# EasyEDA Pro project ax08_duplicate.eprj, board register
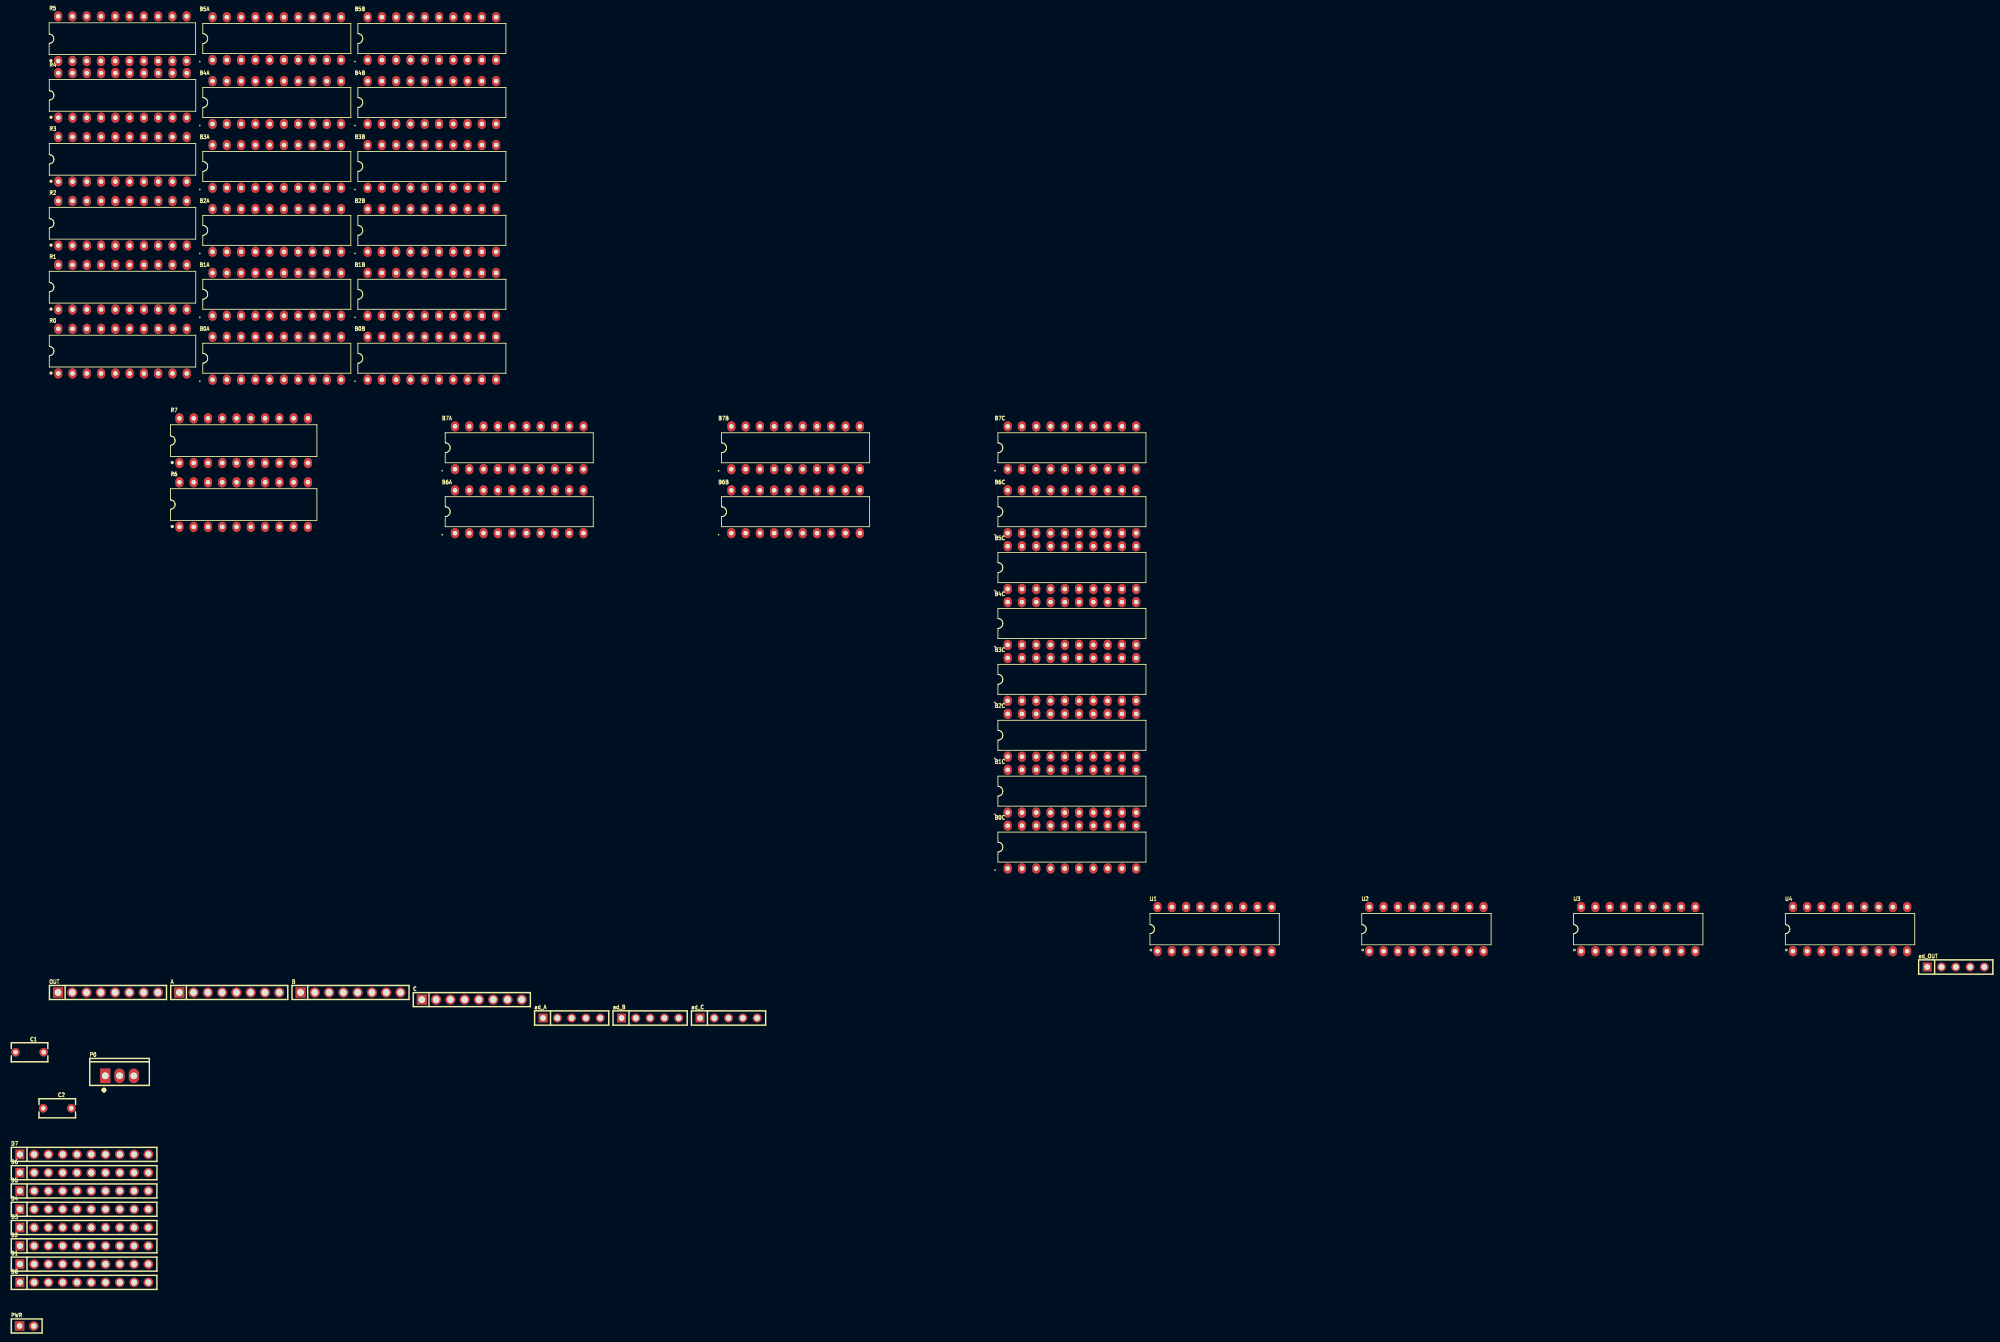
[diagram p9: board, top side]
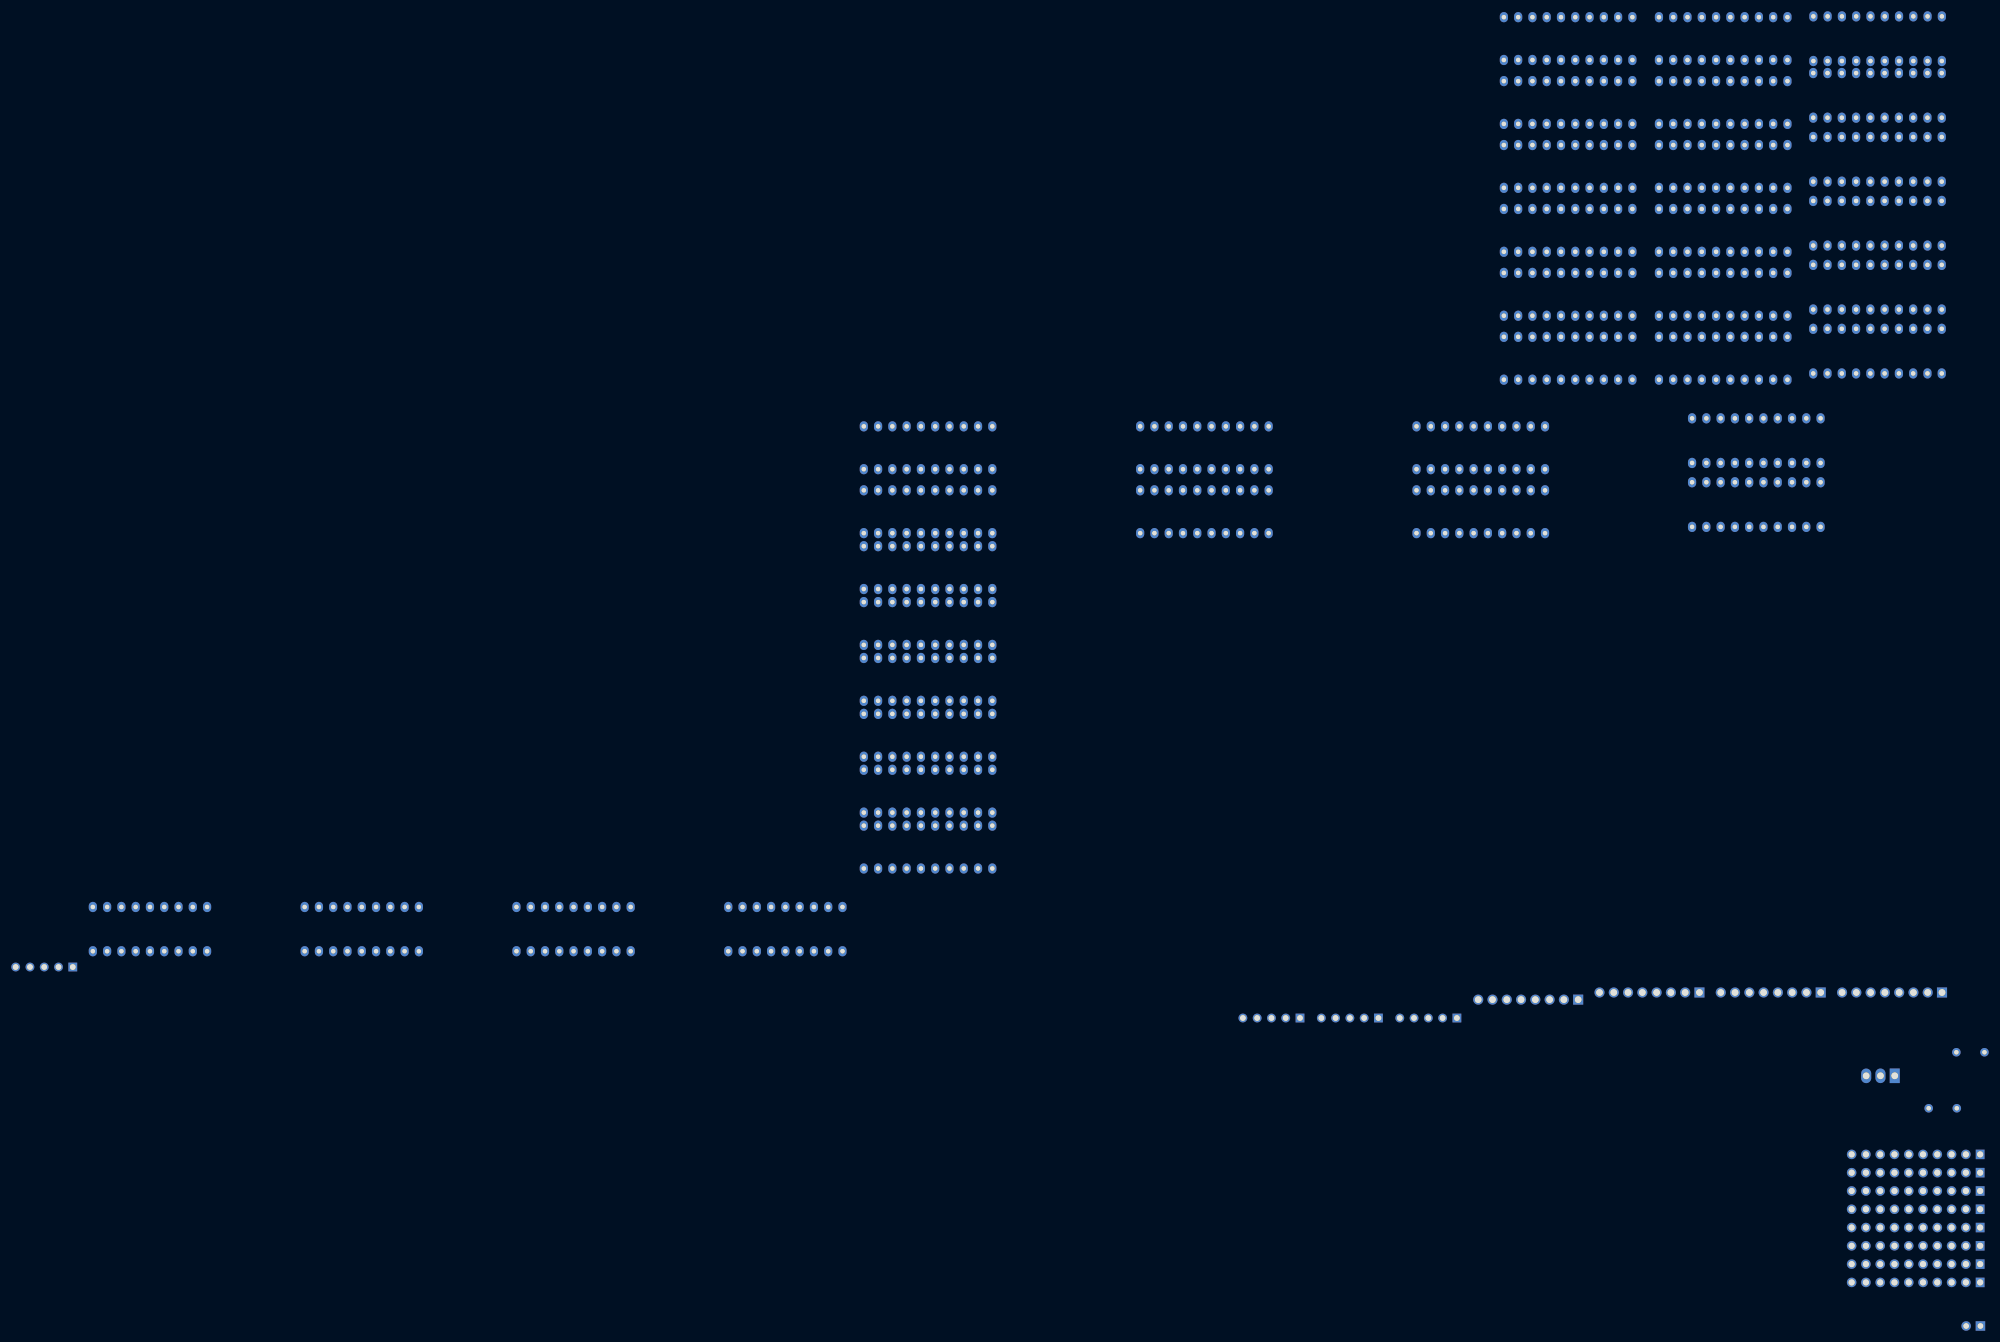
[diagram p10: board, bottom side, seen from below]

No outline. copper layers: Top Layer, Bottom Layer. Coordinates in mm from the lowest, leftmost part position.
Stack: Top Layer 0.035mm / Dielectric1 1.51mm FR4 er 4.5 / Bottom Layer 0.035mm

## Design rules (mm)
template: JLCPCB Capability(Two Layers Board)
spacing copperThickness1oz (default): track to track 0.102, other pairs 0.152 to 0.3
spacing copperThickness2oz: track to track 0.203, other pairs 0.152 to 0.3
track width copperThickness1oz (default): min 0.127, default 0.254, max 2.54
track width copperThickness2oz: min 0.203, default 0.254, max 2.54
differential pair differentialPair (default): width min 0.127, default 0.254, max 2.54; gap min 0.152, default 0.152
via viaSize (default): diameter min 0.5, default 0.61, max 10; hole min 0.3, default 0.305, max 6.3

## Placement (name value [footprint] x y rotation side)
A  2.54-1*8P母环保  [HDR-TH_8P-P2.54-V-F-1]  36.03 59.34 0 top
ad_A  PM254V-11-05-H85  [HDR-TH_5P-P2.54-V-F]  96.94 54.8 0 top
ad_B  PM254V-11-05-H85  [HDR-TH_5P-P2.54-V-F]  110.89 54.8 0 top
ad_C  PM254V-11-05-H85  [HDR-TH_5P-P2.54-V-F]  124.85 54.8 0 top
ad_OUT  PM254V-11-05-H85  [HDR-TH_5P-P2.54-V-F]  343.15 63.87 0 top
B  2.54-1*8P母环保  [HDR-TH_8P-P2.54-V-F-1]  57.6 59.34 0 top
B0A  SN74LS244N(XBLW)  [PDIP-20_L26.2-W7.6-P2.54-LS7.9-BL]  44.49 172.18 0 top
B0B  SN74LS244N(XBLW)  [PDIP-20_L26.2-W7.6-P2.54-LS7.9-BL]  72.07 172.18 0 top
B0C  SN74LS244N(XBLW)  [PDIP-20_L26.2-W7.6-P2.54-LS7.9-BL]  185.93 85.21 0 top
B1A  SN74LS244N(XBLW)  [PDIP-20_L26.2-W7.6-P2.54-LS7.9-BL]  44.49 183.56 0 top
B1B  SN74LS244N(XBLW)  [PDIP-20_L26.2-W7.6-P2.54-LS7.9-BL]  72.07 183.56 0 top
B1C  SN74LS244N(XBLW)  [PDIP-20_L26.2-W7.6-P2.54-LS7.9-BL]  185.93 95.16 0 top
B2A  SN74LS244N(XBLW)  [PDIP-20_L26.2-W7.6-P2.54-LS7.9-BL]  44.49 194.94 0 top
B2B  SN74LS244N(XBLW)  [PDIP-20_L26.2-W7.6-P2.54-LS7.9-BL]  72.07 194.94 0 top
B2C  SN74LS244N(XBLW)  [PDIP-20_L26.2-W7.6-P2.54-LS7.9-BL]  185.93 105.1 0 top
B3A  SN74LS244N(XBLW)  [PDIP-20_L26.2-W7.6-P2.54-LS7.9-BL]  44.49 206.31 0 top
B3B  SN74LS244N(XBLW)  [PDIP-20_L26.2-W7.6-P2.54-LS7.9-BL]  72.07 206.31 0 top
B3C  SN74LS244N(XBLW)  [PDIP-20_L26.2-W7.6-P2.54-LS7.9-BL]  185.93 115.05 0 top
B4A  SN74LS244N(XBLW)  [PDIP-20_L26.2-W7.6-P2.54-LS7.9-BL]  44.49 217.69 0 top
B4B  SN74LS244N(XBLW)  [PDIP-20_L26.2-W7.6-P2.54-LS7.9-BL]  72.07 217.69 0 top
B4C  SN74LS244N(XBLW)  [PDIP-20_L26.2-W7.6-P2.54-LS7.9-BL]  185.93 124.99 0 top
B5A  SN74LS244N(XBLW)  [PDIP-20_L26.2-W7.6-P2.54-LS7.9-BL]  44.49 229.07 0 top
B5B  SN74LS244N(XBLW)  [PDIP-20_L26.2-W7.6-P2.54-LS7.9-BL]  72.07 229.07 0 top
B5C  SN74LS244N(XBLW)  [PDIP-20_L26.2-W7.6-P2.54-LS7.9-BL]  185.93 134.94 0 top
B6A  SN74LS244N(XBLW)  [PDIP-20_L26.2-W7.6-P2.54-LS7.9-BL]  87.61 144.88 0 top
B6B  SN74LS244N(XBLW)  [PDIP-20_L26.2-W7.6-P2.54-LS7.9-BL]  136.77 144.88 0 top
B6C  SN74LS244N(XBLW)  [PDIP-20_L26.2-W7.6-P2.54-LS7.9-BL]  185.93 144.88 0 top
B7A  SN74LS244N(XBLW)  [PDIP-20_L26.2-W7.6-P2.54-LS7.9-BL]  87.61 156.26 0 top
B7B  SN74LS244N(XBLW)  [PDIP-20_L26.2-W7.6-P2.54-LS7.9-BL]  136.77 156.26 0 top
B7C  SN74LS244N(XBLW)  [PDIP-20_L26.2-W7.6-P2.54-LS7.9-BL]  185.93 156.26 0 top
C  2.54-1*8P母环保  [HDR-TH_8P-P2.54-V-F-1]  79.18 58.07 0 top
C1  0.33uF  [CAP-TH_L6.5-W3.4-P5.00-D0.5]  0.51 48.7 0 top
C2  0.1uF  [CAP-TH_L6.5-W3.4-P5.00-D0.5]  5.43 38.74 0 top
D0  PM254-1-10-Z-8.5  [HDR-TH_10P-P2.54-V-F]  10.21 7.75 0 top
D1  PM254-1-10-Z-8.5  [HDR-TH_10P-P2.54-V-F]  10.21 11.01 0 top
D2  PM254-1-10-Z-8.5  [HDR-TH_10P-P2.54-V-F]  10.21 14.26 0 top
D3  PM254-1-10-Z-8.5  [HDR-TH_10P-P2.54-V-F]  10.21 17.52 0 top
D4  PM254-1-10-Z-8.5  [HDR-TH_10P-P2.54-V-F]  10.21 20.77 0 top
D5  PM254-1-10-Z-8.5  [HDR-TH_10P-P2.54-V-F]  10.21 24.02 0 top
D6  PM254-1-10-Z-8.5  [HDR-TH_10P-P2.54-V-F]  10.21 27.28 0 top
D7  PM254-1-10-Z-8.5  [HDR-TH_10P-P2.54-V-F]  10.21 30.53 0 top
OUT  2.54-1*8P母环保  [HDR-TH_8P-P2.54-V-F-1]  14.45 59.34 0 top
P0  L7805  [TO-220-3_L10.0-W4.5-P2.54-L]  16.51 44.51 0 top
PWR  ZX-PM2.54-1-2PY  [HDR-TH_2P-P2.54-V-F]  0 0 0 top
R0  SN74HC373N(XBLW)  [PDIP-20_L25.9-W6.6-P2.54-LS7.9-BL]  17.04 173.45 0 top
R1  SN74HC373N(XBLW)  [PDIP-20_L25.9-W6.6-P2.54-LS7.9-BL]  17.04 184.83 0 top
R2  SN74HC373N(XBLW)  [PDIP-20_L25.9-W6.6-P2.54-LS7.9-BL]  17.04 196.21 0 top
R3  SN74HC373N(XBLW)  [PDIP-20_L25.9-W6.6-P2.54-LS7.9-BL]  17.04 207.58 0 top
R4  SN74HC373N(XBLW)  [PDIP-20_L25.9-W6.6-P2.54-LS7.9-BL]  17.04 218.96 0 top
R5  SN74HC373N(XBLW)  [PDIP-20_L25.9-W6.6-P2.54-LS7.9-BL]  17.02 229.04 0 top
R6  SN74HC373N(XBLW)  [PDIP-20_L25.9-W6.6-P2.54-LS7.9-BL]  38.59 146.15 0 top
R7  SN74HC373N(XBLW)  [PDIP-20_L25.9-W6.6-P2.54-LS7.9-BL]  38.59 157.53 0 top
U1  PIC16F1847-I/P  [PDIP-18_L22.9-W6.4-P2.54-LS7.9-BL]  211.31 70.62 0 top
U2  PIC16F1847-I/P  [PDIP-18_L22.9-W6.4-P2.54-LS7.9-BL]  248.99 70.62 0 top
U3  PIC16F1847-I/P  [PDIP-18_L22.9-W6.4-P2.54-LS7.9-BL]  286.67 70.62 0 top
U4  PIC16F1847-I/P  [PDIP-18_L22.9-W6.4-P2.54-LS7.9-BL]  324.34 70.62 0 top

## Footprints (pads in the part's own frame, mm; a bottom-side part is the same pattern mirrored in y, then rotated)
CAP-TH_L6.5-W3.4-P5.00-D0.5
  round 1.524 hole 0.8: 1(-2.5,0) 2(2.5,0)
HDR-TH_2P-P2.54-V-F
  rect 1.7x1.7 hole 1: 1(-1.27,0)
  round 1.7 hole 1: 2(1.27,0)
HDR-TH_5P-P2.54-V-F
  rect 1.575x1.575 hole 1.02: 1(-5.08,0)
  round 1.575 hole 1.02: 2(-2.54,0) 3(0,0) 4(2.54,0) 5(5.08,0)
HDR-TH_8P-P2.54-V-F-1
  rect 1.8x1.8 hole 1.2: 1(-8.89,0)
  round 1.8 hole 1.2: 2(-6.35,0) 3(-3.81,0) 4(-1.27,0) 5(1.27,0) 6(3.81,0) 7(6.35,0) 8(8.89,0)
HDR-TH_10P-P2.54-V-F
  rect 1.575x1.7 hole 1.1: 1(-11.43,0)
  round 1.7 hole 1.1: 2(-8.89,0) 3(-6.35,0) 4(-3.81,0) 5(-1.27,0) 6(1.27,0) 7(3.81,0) 8(6.35,0) 9(8.89,0) 10(11.43,0)
PDIP-18_L22.9-W6.4-P2.54-LS7.9-BL
  oval 1.462x1.827 hole 0.8: 1(-10.16,-3.935) 2(-7.62,-3.935) 3(-5.08,-3.935) 4(-2.54,-3.935) 5(0,-3.935) 6(2.54,-3.935) 7(5.08,-3.935) 8(7.62,-3.935) 9(10.16,-3.935) 10(10.16,3.935) 11(7.62,3.935) 12(5.08,3.935) 13(2.54,3.935) 14(0,3.935) 15(-2.54,3.935) 16(-5.08,3.935) 17(-7.62,3.935) 18(-10.16,3.935)
PDIP-20_L25.9-W6.6-P2.54-LS7.9-BL
  oval 1.462x1.827 hole 0.8: 1(-11.43,-3.97) 2(-8.89,-3.97) 3(-6.35,-3.97) 4(-3.81,-3.97) 5(-1.27,-3.97) 6(1.27,-3.97) 7(3.81,-3.97) 8(6.35,-3.97) 9(8.89,-3.97) 10(11.43,-3.97) 11(11.43,3.97) 12(8.89,3.97) 13(6.35,3.97) 14(3.81,3.97) 15(1.27,3.97) 16(-1.27,3.97) 17(-3.81,3.97) 18(-6.35,3.97) 19(-8.89,3.97) 20(-11.43,3.97)
PDIP-20_L26.2-W7.6-P2.54-LS7.9-BL
  oval 1.46x1.825 hole 0.8: 1(-11.43,-3.81) 2(-8.89,-3.81) 3(-6.35,-3.81) 4(-3.81,-3.81) 5(-1.27,-3.81) 6(1.27,-3.81) 7(3.81,-3.81) 8(6.35,-3.81) 9(8.89,-3.81) 10(11.43,-3.81) 11(11.43,3.81) 12(8.89,3.81) 13(6.35,3.81) 14(3.81,3.81) 15(1.27,3.81) 16(-1.27,3.81) 17(-3.81,3.81) 18(-6.35,3.81) 19(-8.89,3.81) 20(-11.43,3.81)
TO-220-3_L10.0-W4.5-P2.54-L
  rect 1.8x2.6 hole 1.2: 1(-2.54,0.005)
  oval 1.8x2.6 hole 1.2: 2(0,0.005) 3(2.54,-0.005)

## Nets
As in the schematic.

Pads without a net: U1 4 15 16; U2 4 15 16; U3 4 15 16; U4 4 15 16
